# Altium schematic sheet Btn_Ctrl.SchDoc: Button control
size A4; SheetNumber: 2; SheetTotal: 6; Designer: Matthieu Menager
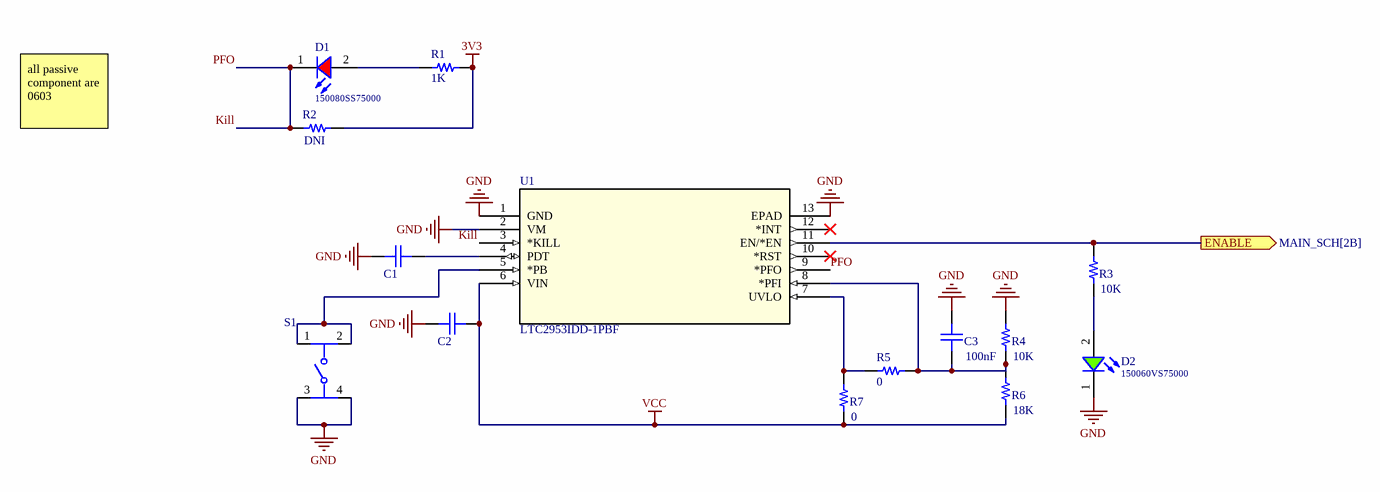
[diagram p0: Btn_Ctrl.SchDoc]

## Parts
C1  Capacitor  [FP-CL10-IPC_B]  (value not drawn)
C2  Capacitor  [FP-CL10-IPC_B]  (value not drawn)
C3  100nF  [FP-CL10-IPC_B]
D1  150080SS75000  [WL-SMCW_0805]
D2  150060VS75000  [WL-SMCW_0603_H=0.7mm]
R1  1K  [R_10k_JLC]
R2  DNI  [R_10k_JLC]
R3  10K  [R_10k_JLC]
R4  10K  [R_10k_JLC]
R5  0  [R_10k_JLC]
R6  18K  [R_10k_JLC]
R7  0  [R_10k_JLC]
S1  PTS645SH50SMTR92LFS  [FP-PTS645SM43SMTR92LFS-MFG]  (value not drawn)
U1  LTC2953IDD-1PBF  [DFN-12_DD_LIT]

## Ports
ENABLE (out, see MAIN_SCH[2B])

## Nets
3V3: R1.2 R2.2
GND: C1.1 C2.2 C3.2 D2.1(K) R4.2 S1.3 S1.4 U1.1(GND) U1.2(VM) U1.13(EPAD)
VCC: C2.1 R6.1 R7.1 U1.6(VIN)
ENABLE: R3.2 U1.11(EN/*EN) ; port ENABLE
Kill: D1.1(K) R2.1 U1.3(*KILL) U1.9(*PFO)  [also labelled PFO]
NetC1_2: C1.2 U1.4(PDT)
NetC3_1: C3.1 R4.1 R5.1 R6.2 U1.8(*PFI)
NetD1_2: D1.2(A) R1.1
NetD2_2: D2.2(A) R3.1
NetR5_2: R5.2 R7.2 U1.7(UVLO)
NetS1_1: S1.1 S1.2 U1.5(*PB)

Not connected (* = marked no-connect by the designer): U1 10(*RST)* 12(*INT)*

## Notes on the sheet
- all passive component are 0603
- Title
- Size:
- Date:
- A4
- Designer:
- Time:
- Sheet
- Revision:
- of
- University of Stuttgart
- ILH
- Pfaffenwaldring 47
- 70569 Stuttgart
- Germany
- File:

## Library data of the parts
C1-C3 = CMP-024-000000-16: SMT Capacitor; Value: 0µF; Design Item ID: Capacitor; Source: Passives.SchLib
D1 = CMP-027-000004-2: WL-SMCW SMT Mono-color Chip LED Waterclear, size 0805, Super Red, 1.9V, 140deg; Peak Wavelength typ.: 645nm; Chip Technology: AlInGaP; Dominant Wavelength typ.: 630nm; Luminous Intensity typ.: 60mcd; Operating Temperature: -40 to +85degC; Design Item ID: 150080SS75000; Size: 0805; Packaging: Tape and Reel; Emitting Color: Super Red; ComponentLink1URL: http://www.we-online.de; Part Number: 150080SS75000; Published Date: December 2019; ComponentLink2Description: Datasheet; ComponentLink2URL: https://www.we-online.com/catalog/datasheet/150080SS75000.pdf; Source: WL-SMCW_0805.SchLib; ComponentLink1Description: Manufacturer; Viewing Angle: 140deg; Forward Voltage typ.: 1.9V; Publisher: Wurth Elektronik; Mounting Technology: SMT
D2 = CMP-029-000010-2: WL-SMCW SMT Mono-color Chip LED Waterclear, size 0603, Bright Green, 2V, 140deg; Luminous Intensity typ.: 40mcd; Chip Technology: AlInGaP; Dominant Wavelength typ.: 570nm; Peak Wavelength typ.: 572nm; ComponentLink2Description: Datasheet; Published Date: December 2019; Part Number: 150060VS75000; Source: WL-SMCW_0603.SchLib; Size: 0603; ComponentLink1Description: Manufacturer; Emitting Color: Bright Green; Packaging: Tape and Reel; Operating Temperature: -40 to +85degC; ComponentLink1URL: http://www.we-online.de; Publisher: Wurth Elektronik; Design Item ID: 150060VS75000; Forward Voltage typ.: 2V; ComponentLink2URL: https://www.we-online.com/catalog/datasheet/150060VS75000.pdf; Mounting Technology: SMT; Viewing Angle: 140deg
R1 R2 R5-R7 = CMP-009-00207-1: Fixed Resistor, Metal Glaze/thick Film, 0.1W, 10000ohm, 50V, 1% +/-Tol, 100ppm/Cel, Surface Mount, 0603; Value: 10k; Power: 100mW; Case/Package: 0603; Pins: 2; Min Operating Temperature: -55°C; JLCPCB Part #: C25804; Tolerance: 1%; Mounting Technology: Surface Mount; Max Operating Temperature: 155°C; RoHS Compliant: Yes
R3 R4 = CMP-009-00207-1: Fixed Resistor, Metal Glaze/thick Film, 0.1W, 10000ohm, 50V, 1% +/-Tol, 100ppm/Cel, Surface Mount, 0603; Power: 100mW; Case/Package: 0603; Pins: 2; Min Operating Temperature: -55°C; JLCPCB Part #: C25804; Value: 10k; Tolerance: 1%; Mounting Technology: Surface Mount; Max Operating Temperature: 155°C; RoHS Compliant: Yes
S1 = CMP-011-00001-2: Switch Tactile N.O. SPST Round Button Gull Wing 0.05A 12VDC 100000Cycles 1.96N SMD T/R
U1 = LTC2953IDD-1PBF: No Description Available; Mfr_Name: Analog Devices Inc; RefDes: RefDes; Type: Type